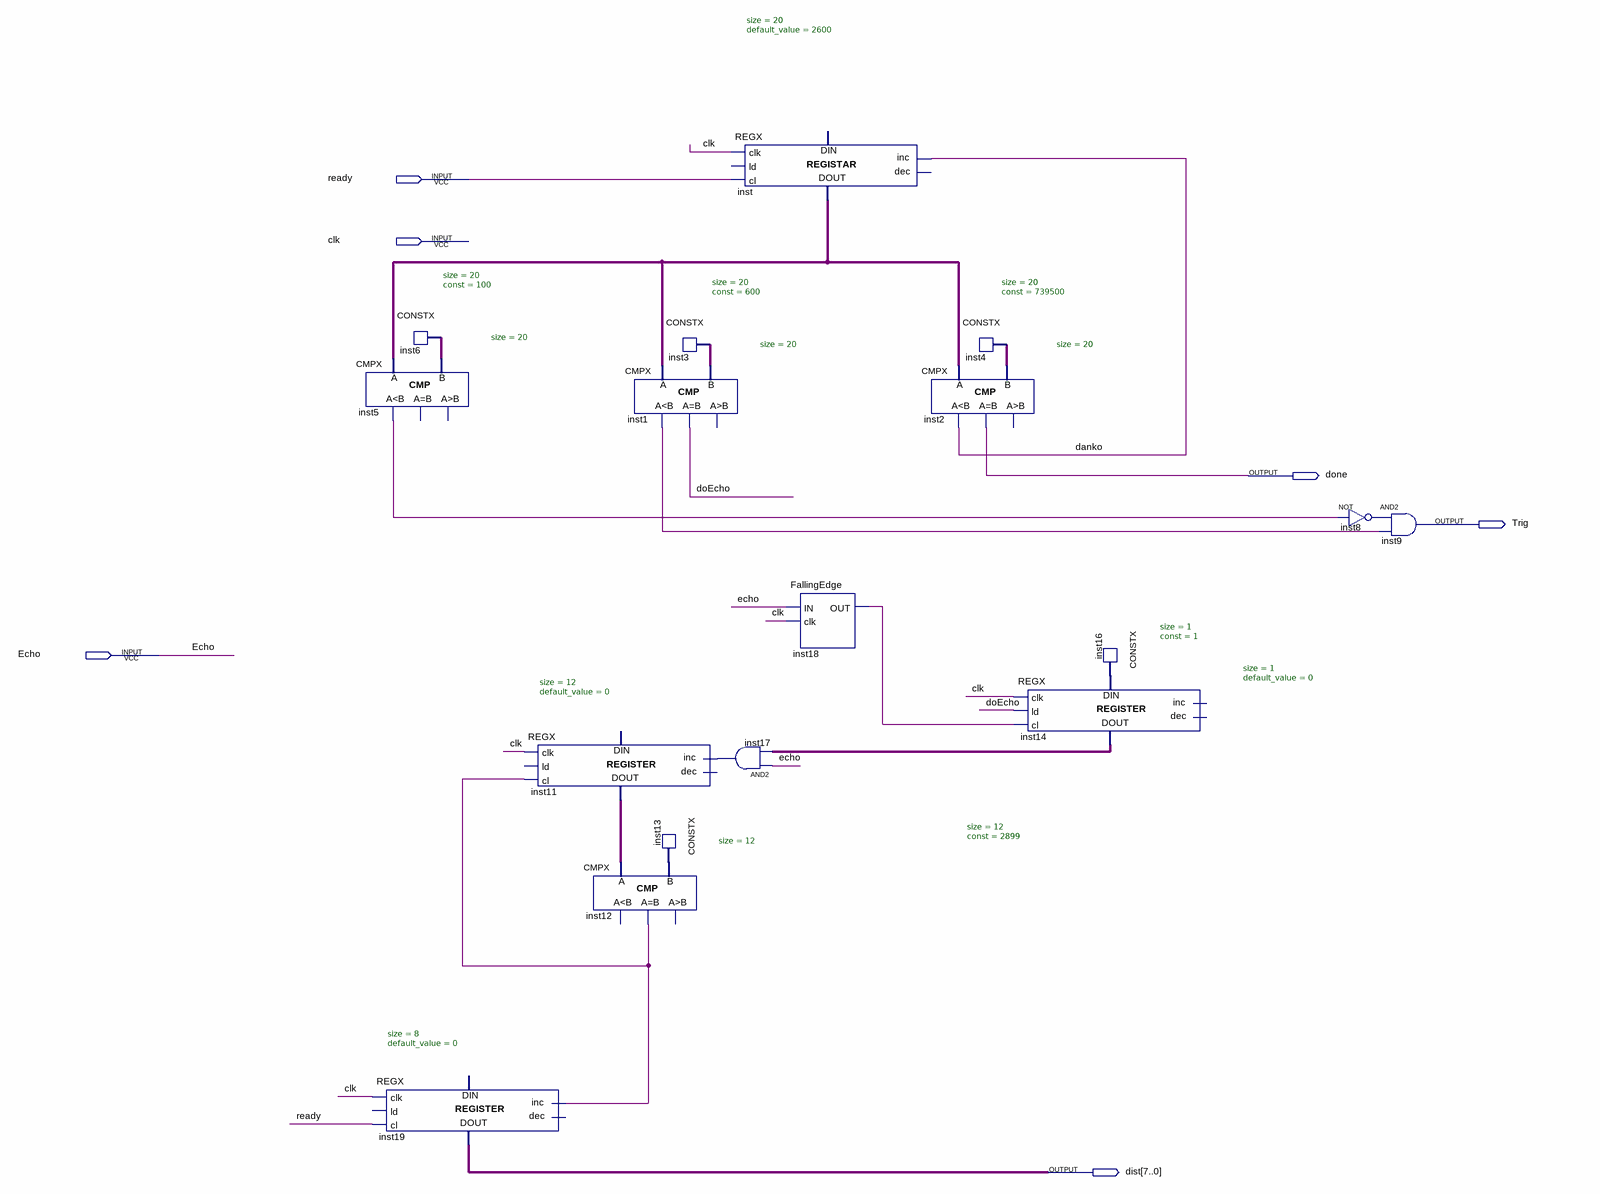
[diagram p0: schematic sheet]
// Quartus schematic SensorControl.bdf as structural Verilog: 17 symbols, 6 pins
module SensorControl (
  input  ready,
  input  clk,
  input  Echo,
  output done,
  output Trig,
  output [7:0] \dist 
);

  wire danko, doEcho, inst1_ls, inst5_ls, inst8_out, inst12_eq, inst14_data_out, inst16_data, inst17_out,
       inst18_out;
  wire [11:0] inst11_data_out, inst13_data;
  wire [19:0] inst3_data, inst4_data, inst6_data, inst_data_out;

  CMPX #(.size(20)) inst5 (.A(inst_data_out), .B(inst6_data), .ls(inst5_ls));  // open: eq, gr
  REGX #(.size(8), .default_value(0)) inst19 (
    .clk(clk), .cl(ready), .inc(inst12_eq), .data_out(\dist ));  // open: ld, dec, data_in
  CONSTX #(.size(20), .\const (100)) inst6 (.data(inst6_data));
  REGX #(.size(12), .default_value(0)) inst11 (
    .clk(clk), .cl(inst12_eq), .inc(inst17_out), .data_out(inst11_data_out));  // open: ld, dec, data_in
  CMPX #(.size(12)) inst12 (.A(inst11_data_out), .B(inst13_data), .eq(inst12_eq));  // open: ls, gr
  CONSTX #(.size(20), .\const (600)) inst3 (.data(inst3_data));
  CMPX #(.size(20)) inst1 (.A(inst_data_out), .B(inst3_data), .ls(inst1_ls), .eq(doEcho));  // open: gr
  CONSTX #(.size(12), .\const (2899)) inst13 (.data(inst13_data));
  and inst17 (inst17_out, Echo, inst14_data_out);
  REGX #(.size(20), .default_value(2600)) inst (
    .clk(clk), .cl(ready), .inc(danko), .data_out(inst_data_out));  // open: ld, dec, data_in
  FallingEdge inst18 (.IN(Echo), .clk(clk), .OUT(inst18_out));
  CMPX #(.size(20)) inst2 (.A(inst_data_out), .B(inst4_data), .ls(danko), .eq(done));  // open: gr
  CONSTX #(.size(20), .\const (739500)) inst4 (.data(inst4_data));
  REGX #(.size(1), .default_value(0)) inst14 (
    .clk(clk), .ld(doEcho), .cl(inst18_out), .data_in(inst16_data), .data_out(inst14_data_out));  // open: inc, dec
  CONSTX #(.size(1), .\const (1)) inst16 (.data(inst16_data));
  not inst8 (inst8_out, inst5_ls);
  and inst9 (Trig, inst8_out, inst1_ls);
endmodule
